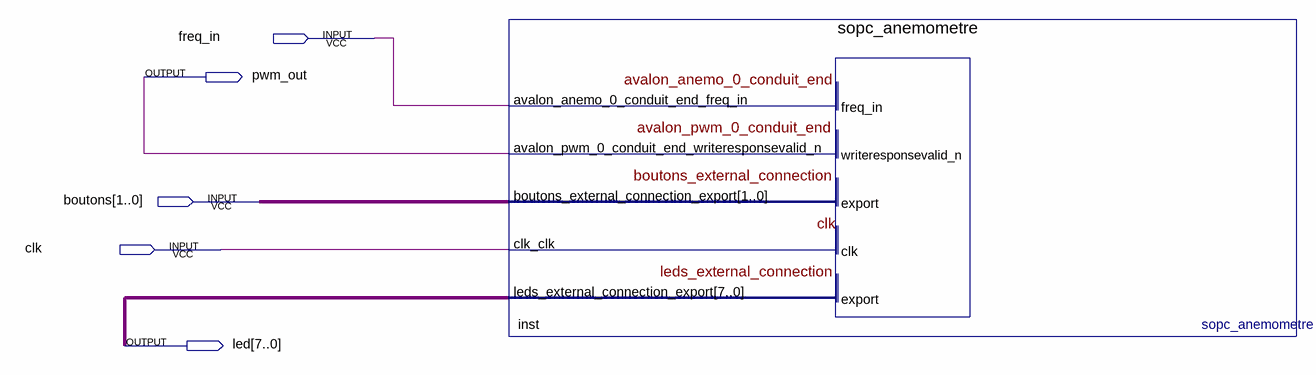
[diagram p0: schematic sheet]
// Quartus schematic sopc_anemometre.bdf as structural Verilog: 1 symbols, 5 pins
module sopc_anemometre (
  input  freq_in,
  input  [1:0] boutons,
  input  clk,
  output pwm_out,
  output [7:0] led
);

  sopc_anemometre inst (
    .avalon_anemo_0_conduit_end_freq_in(freq_in), .boutons_external_connection_export(boutons),
    .clk_clk(clk), .avalon_pwm_0_conduit_end_writeresponsevalid_n(pwm_out),
    .leds_external_connection_export(led));
endmodule
